# EAGLE schematic rpiz_can (EAGLE 8.1.1)

## Sheet 1 of 2
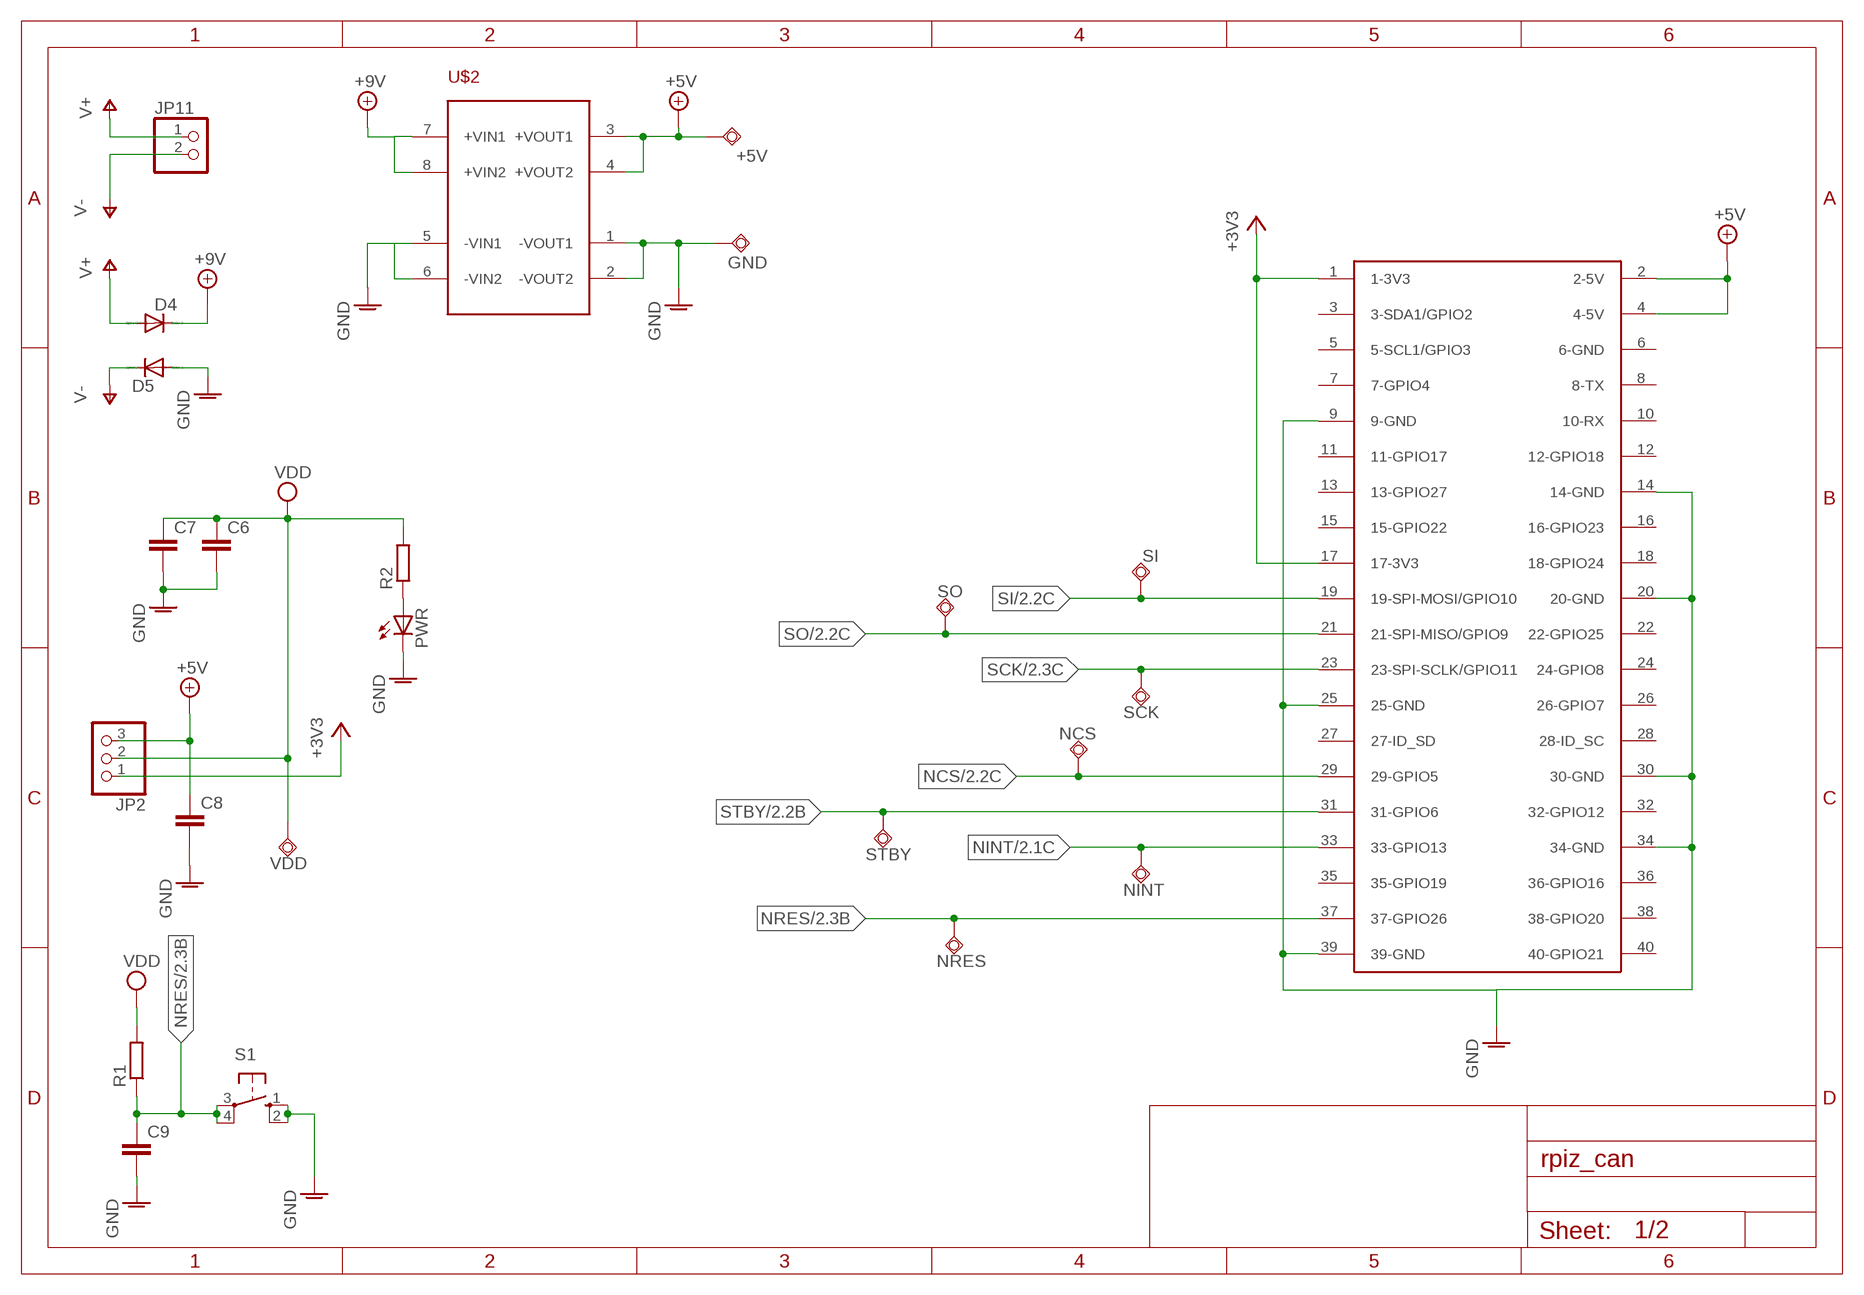
[diagram p0: schematic, sheet 1]

### Parts
+5V  TPSQTP20SQ  [TP20SQ]
C6  C-EUC0805  [C0805]
C7  C-EUC0805  [C0805]
C8  C-EUC0805  [C0805]
C9  C-EUC0805  [C0805]
D4  1N4148DO35-7  [DO35-7]
D5  1N4148DO35-7  [DO35-7]
GND  TPSQTP20SQ  [TP20SQ]
JP2  PINHD-1X3  [1X03]
JP11  PINHD-1X2  [1X02]
NCS  TPSQTP20SQ  [TP20SQ]
NINT  TPSQTP20SQ  [TP20SQ]
NRES  TPSQTP20SQ  [TP20SQ]
PWR  LEDCHIP-LED0603  [CHIP-LED0603]
R1  R-EU_R0805  [R0805]
R2  R-EU_R0805  [R0805]
S1  10-XX  [B3F-10XX]
SCK  TPSQTP20SQ  [TP20SQ]
SI  TPSQTP20SQ  [TP20SQ]
SO  TPSQTP20SQ  [TP20SQ]
STBY  TPSQTP20SQ  [TP20SQ]
U$2  LVPS  [LVPS]
U$3  RASPBERRY-PI+RASPBERRY-PI-ZERO_LONG  [RASPBERRY-PI-ZERO]
VDD  TPSQTP20SQ  [TP20SQ]

### Nets
+3V3: JP2.1 U$3.1(1-3V3) U$3.17(17-3V3)
+5V: +5V.TP C8.1 JP2.3 U$2.3(+VOUT1) U$2.4(+VOUT2) U$3.2(2-5V) U$3.4(4-5V)
+9V: D4.C U$2.7(+VIN1) U$2.8(+VIN2)
AGND: C6.2 C7.2 ; supply symbol labelled GND
GND: C8.2 C9.2 D5.A GND.TP PWR.C S1.1(S) S1.2(S1) U$2.1(-VOUT1) U$2.2(-VOUT2) U$2.5(-VIN1) U$2.6(-VIN2) U$3.9(9-GND) U$3.14(14-GND) U$3.20(20-GND) U$3.25(25-GND) U$3.30(30-GND) U$3.34(34-GND) U$3.39(39-GND) ; also sheet 2
N$4: PWR.A R2.1
NCS: NCS.TP U$3.29(29-GPIO5) ; also sheet 2
NINT: NINT.TP U$3.33(33-GPIO13) ; also sheet 2
NRES: C9.1 NRES.TP R1.1 S1.3(P) S1.4(P1) U$3.37(37-GPIO26) ; also sheet 2
SCK: SCK.TP U$3.23(23-SPI-SCLK/GPIO11) ; also sheet 2
SI: SI.TP U$3.19(19-SPI-MOSI/GPIO10) ; also sheet 2
SO: SO.TP U$3.21(21-SPI-MISO/GPIO9) ; also sheet 2
STBY: STBY.TP U$3.31(31-GPIO6) ; also sheet 2
V+: D4.A JP11.1
V-: D5.C JP11.2
VDD: C6.1 C7.1 JP2.2 R1.2 R2.2 VDD.TP ; also sheet 2
Unconnected: U$3.3(3-SDA1/GPIO2) U$3.5(5-SCL1/GPIO3) U$3.6(6-GND) U$3.7(7-GPIO4) U$3.8(8-TX) U$3.10(10-RX) U$3.11(11-GPIO17) U$3.12(12-GPIO18) U$3.13(13-GPIO27) U$3.15(15-GPIO22) U$3.16(16-GPIO23) U$3.18(18-GPIO24) U$3.22(22-GPIO25) U$3.24(24-GPIO8) U$3.26(26-GPIO7) U$3.27(27-ID_SD) U$3.28(28-ID_SC) U$3.32(32-GPIO12) U$3.35(35-GPIO19) U$3.36(36-GPIO16) U$3.38(38-GPIO20) U$3.40(40-GPIO21)

## Sheet 2 of 2
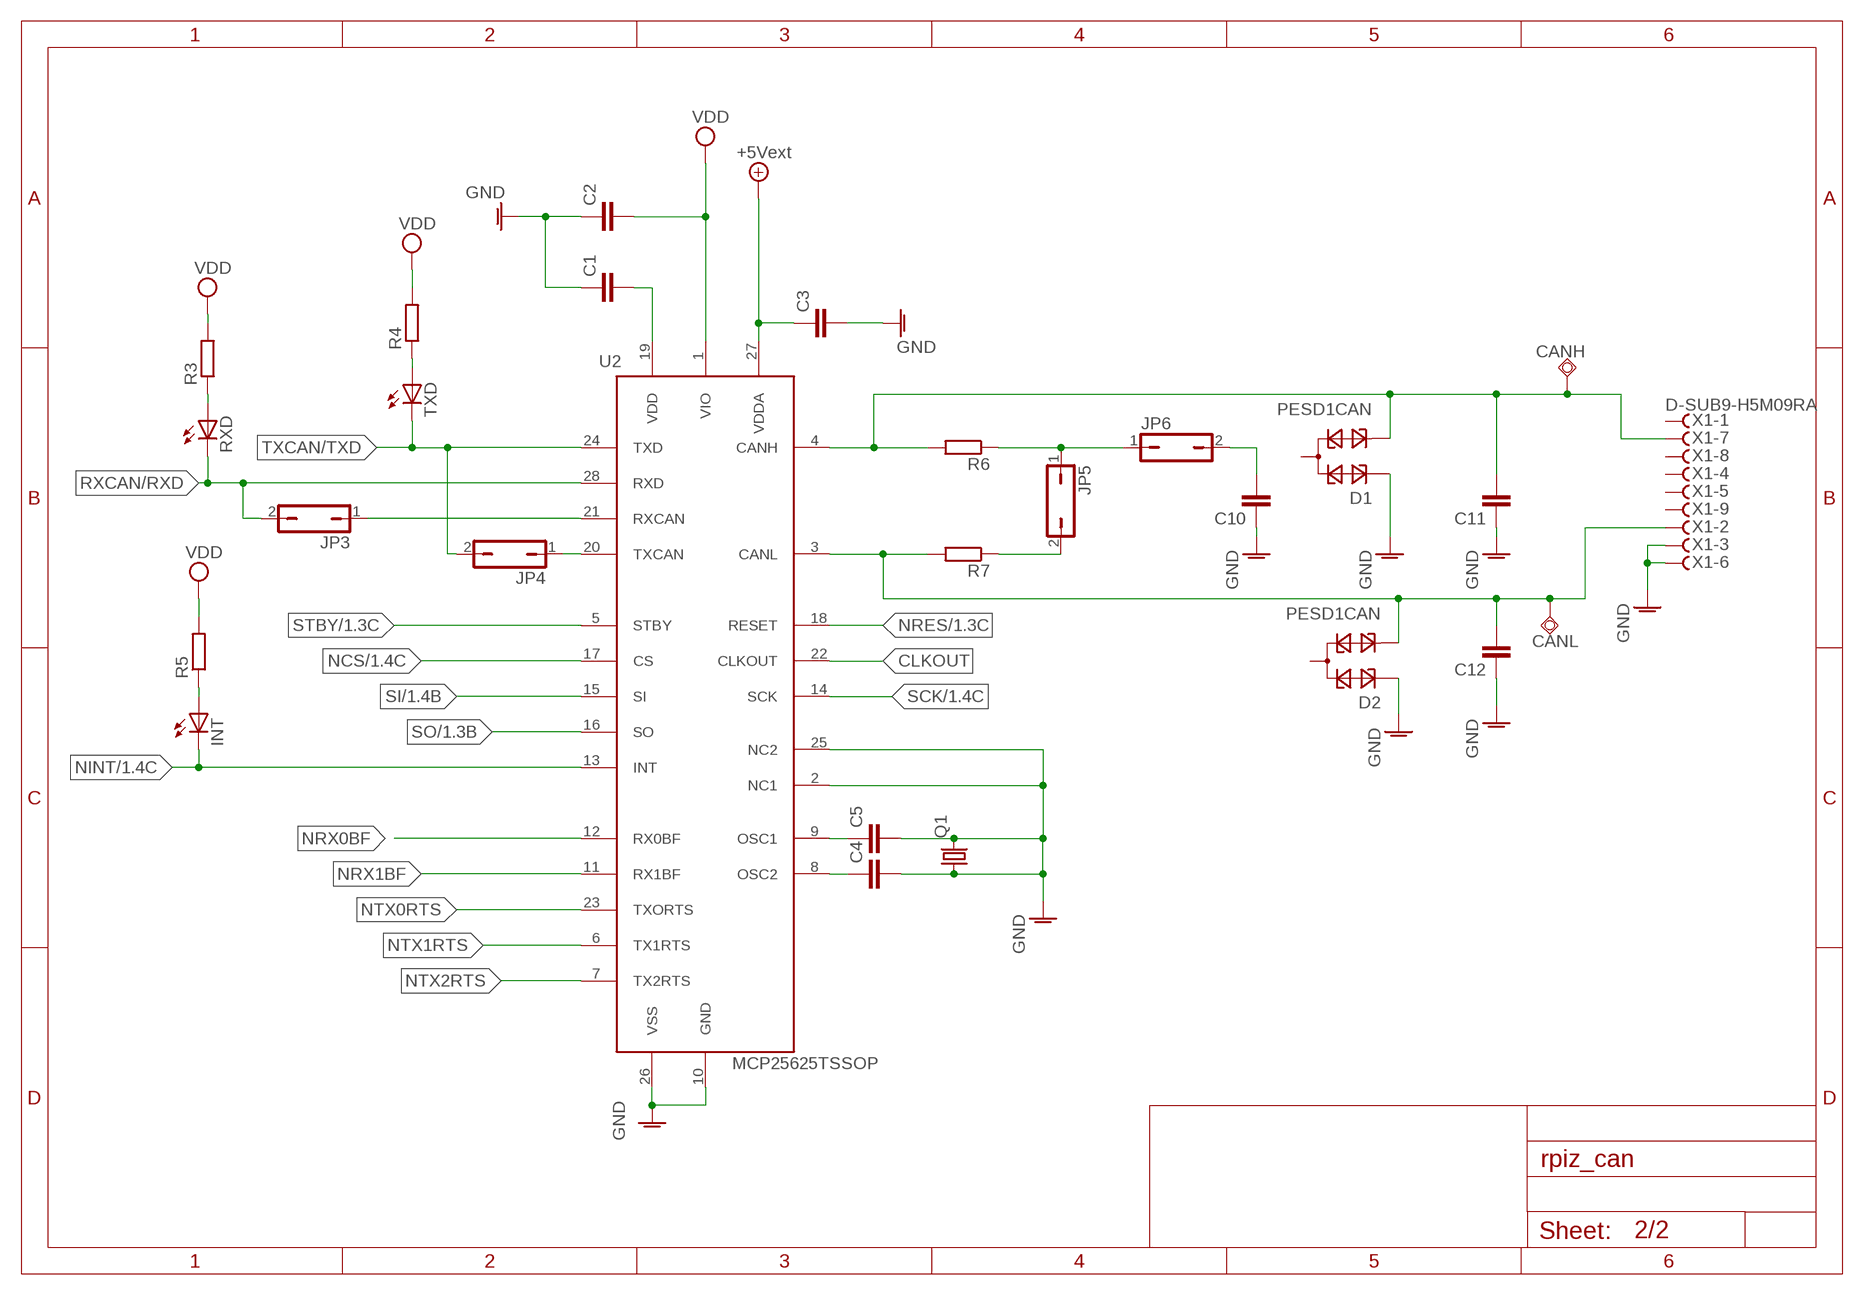
[diagram p1: schematic, sheet 2]

### Parts
C1  C-EUC0805  [C0805]
C2  C-EUC0805  [C0805]
C3  C-EUC0805  [C0805]
C4  C-EUC0805  [C0805]
C5  C-EUC0805  [C0805]
C10  C-EUC0805  [C0805]
C11  C-EUC0805  [C0805]
C12  C-EUC0805  [C0805]
CANH  TPSQTP20SQ  [TP20SQ]
CANL  TPSQTP20SQ  [TP20SQ]
D1  PESD1CAN  [SOT23]
D2  PESD1CAN  [SOT23]
INT  LEDCHIP-LED0603  [CHIP-LED0603]
JP3  JP1Q  [JP1]
JP4  JP1Q  [JP1]
JP5  JP1Q  [JP1]
JP6  JP1Q  [JP1]
Q1  CRYSTALSM49  [SM49]
R3  R-EU_R0805  [R0805]
R4  R-EU_R0805  [R0805]
R5  R-EU_R0805  [R0805]
R6  R-EU_R0805  [R0805]
R7  R-EU_R0805  [R0805]
RXD  LEDCHIP-LED0603  [CHIP-LED0603]
TXD  LEDCHIP-LED0603  [CHIP-LED0603]
U2  MCP25625TSSOP  [TSSOP-28]
X1  D-SUB9-H5M09RA  [H5M09RA]

### Nets
+5V/1: C3.1 U2.27(VDDA) ; supply symbol labelled +5Vext
CLKOUT: U2.22(CLKOUT)
GND: C1.1 C2.1 C3.2 C4.2 C5.2 C10.1 C11.1 C12.1 D1.1 D2.1 Q1.1 Q1.2 U2.2(NC1) U2.10(GND) U2.25(NC2) U2.26(VSS) X1.3 X1.6 ; also sheet 1
N$1: JP3.1 U2.21(RXCAN)
N$2: R3.1 RXD.A
N$3: JP4.1 U2.20(TXCAN)
N$5: R4.1 TXD.A
N$6: INT.A R5.1
N$7: C5.1 U2.9(OSC1)
N$9: C4.1 U2.8(OSC2)
N$10: C11.2 CANH.TP D1.2 R6.2 U2.4(CANH) X1.7
N$11: C1.2 U2.19(VDD)
N$12: C12.2 CANL.TP D2.2 R7.2 U2.3(CANL) X1.2
N$13: JP5.1 JP6.1 R6.1
N$14: JP5.2 R7.1
N$15: C10.2 JP6.2
NCS: U2.17(CS) ; also sheet 1
NINT: INT.C U2.13(INT) ; also sheet 1
NRES: U2.18(RESET) ; also sheet 1
NRX0BF: U2.12(RX0BF)
NRX1BF: U2.11(RX1BF)
NTX0RTS: U2.23(TXORTS)
NTX1RTS: U2.6(TX1RTS)
NTX2RTS: U2.7(TX2RTS)
RXCAN/RXD: JP3.2 RXD.C U2.28(RXD)
SCK: U2.14(SCK) ; also sheet 1
SI: U2.15(SI) ; also sheet 1
SO: U2.16(SO) ; also sheet 1
STBY: U2.5(STBY) ; also sheet 1
TXCAN/TXD: JP4.2 TXD.C U2.24(TXD)
VDD: C2.2 R3.2 R4.2 R5.2 U2.1(VIO) ; also sheet 1
Unconnected: D1.3 D2.3 X1.1 X1.4 X1.5 X1.8 X1.9

## Library data of the parts
+5V CANH CANL GND NCS NINT NRES SCK SI SO STBY VDD = testpad:TPSQ: Test pad
C1-C12 = rcl:C-EU: CAPACITOR, European symbol
D1 D2 = diode:PESD1CAN: CAN bus ESD protection diode Source: http://www.nxp.com/documents/data_sheet/PESD1CAN.pdf
D4 D5 = diode:1N4148: DIODE high speed (Philips)
INT PWR RXD TXD = led:LED: LED OSRAM: - CHIPLED LG R971, LG N971, LY N971, LG Q971, LY Q971, LO R971, LY R971 LH N974, LH R974 LS Q976, LO Q976, LY Q976 LO Q996 - Hyper CHIPLED LW Q18S LB Q993, LB Q99A, LB R99A - SideLED LS A670, LO A670, LY A670, LG A670, LP A670 LB A673, LV A673, LT A673, LW A673 LH A674 LY A675 LS A676, LA A676, LO A676, LY A676, LW A676 LS A679, LY A679, LG A679 - Hyper Micro SIDELED® LS Y876, LA Y876, LO Y876, LY Y876 LT Y87S - SmartLED LW L88C, LW L88S LB L89C, LB L89S, LG L890 LS L89K, LO L89K, LY L89K LS L896, LA L896, LO L896, LY L896 - TOPLED LS T670, LO T670, LY T670, LG T670, LP T670 LSG T670, LSP T670, LSY T670, LOP T670, LYG T670 LG T671, LOG T671, LSG T671 LB T673, LV T673, LT T673, LW T673 LH T674 LS T676, LA T676, LO T676, LY T676, LB T676, LH T676, LSB T676, LW T676 LB T67C, LV T67C, LT T67C, LS T67K, LO T67K, LY T67K, LW E67C LS E67B, LA E67B, LO E67B, LY E67B, LB E67C, LV E67C, LT E67C LW T67C LS T679, LY T679, LG T679 LS T770, LO T770, LY T770, LG T770, LP T770 LB T773, LV T773, LT T773, LW T773 LH T774 LS E675, LA E675, LY E675, LS T675 LS T776, LA T776, LO T776, LY T776, LB T776 LHGB T686 LT T68C, LB T68C - Hyper Mini TOPLED® LB M676 - Mini TOPLED Santana® LG M470 LS M47K, LO M47K, LY M47K Source: http://www.osram.convergy.de LUXEON: - LUMILED® LXK2-PW12-R00, LXK2-PW12-S00, LXK2-PW14-U00, LXK2-PW14-V00 LXK2-PM12-R00, LXK2-PM12-S00, LXK2-PM14-U00 LXK2-PE12-Q00, LXK2-PE12-R00, LXK2-PE12-S00, LXK2-PE14-T00, LXK2-PE14-U00 LXK2-PB12-K00, LXK2-PB12-L00, LXK2-PB12-M00, LXK2-PB14-N00, LXK2-PB14-P00, LXK2-PB14-Q00 LXK2-PR12-L00, LXK2-PR12-M00, LXK2-PR14-Q00, LXK2-PR14-R00 LXK2-PD12-Q00, LXK2-PD12-R00, LXK2-PD12-S00 LXK2-PH12-R00, LXK2-PH12-S00 LXK2-PL12-P00, LXK2-PL12-Q00, LXK2-PL12-R00 Source: www.luxeon.com KINGBRIGHT: KA-3528ASYC Source: www.kingbright.com
JP2 = pinhead:PINHD-1X3: PIN HEADER
JP3-JP6 = jumper:JP1Q: JUMPER
JP11 = pinhead:PINHD-1X2: PIN HEADER
Q1 = crystal:CRYSTAL: CRYSTAL; OC_FARNELL: unknown; OC_NEWARK: unknown
R1-R7 = rcl:R-EU_: RESISTOR, European symbol
S1 = switch-omron:10-XX: OMRON SWITCH; MPN: B3F-1000; OC_FARNELL: 176432; OC_NEWARK: 36M3542
U2 = MCP25625:MCP25625
U$2 = SWI_COMMONS:LVPS: Low Voltage Power Supply
U$3 = SWI_COMMONS:RASPBERRY-PI+: Samtec SSW-120-01-T-D
X1 = con-thomas-betts:D-SUB9-: D-Subminiatur Connector Source: Electronioc Interconnects European Edition 1998; OC_FARNELL: unknown; OC_NEWARK: unknown